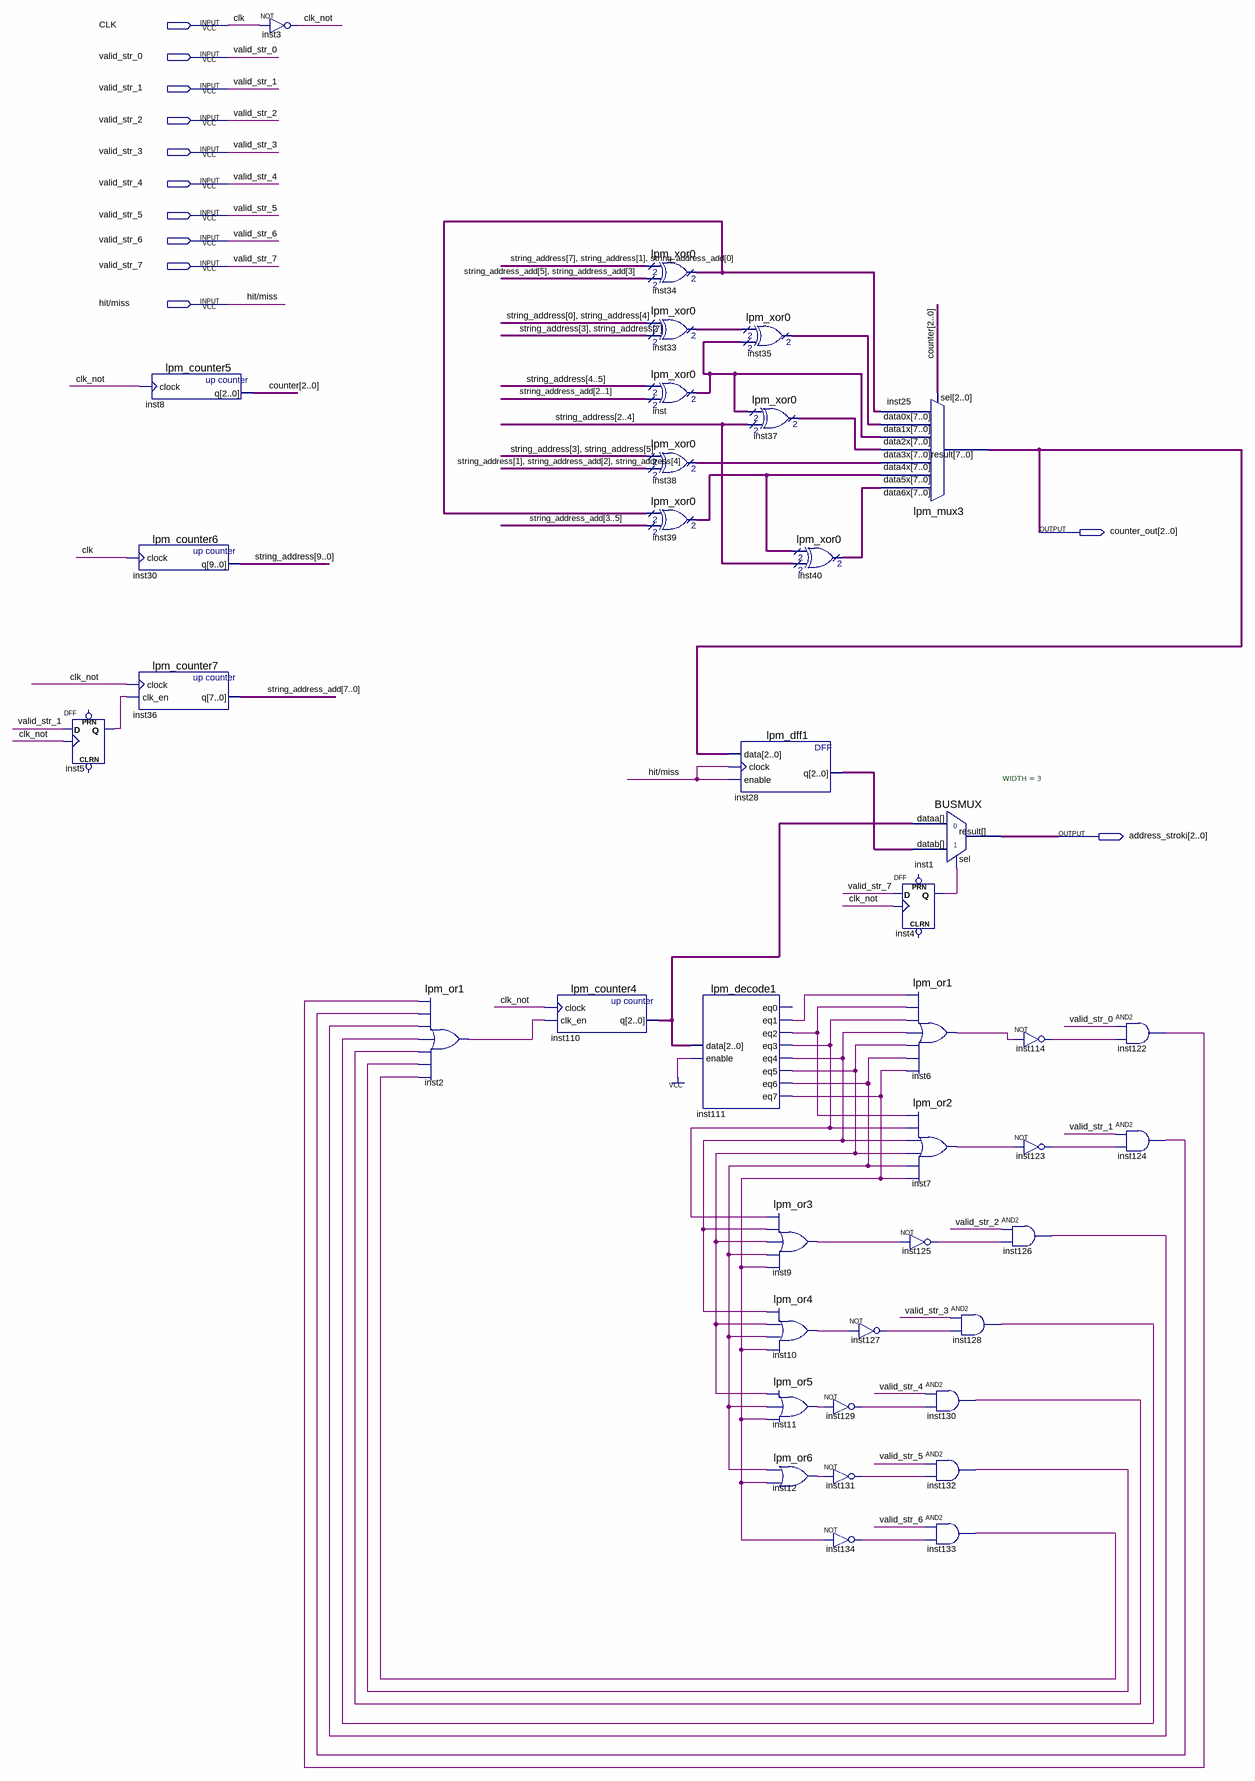
[diagram p0: schematic sheet]
// Quartus schematic Blok_comparing.bdf as structural Verilog: 40 symbols, 12 pins
module Blok_comparing (
  input  CLK,
  input  valid_str_0,
  input  valid_str_1,
  input  valid_str_2,
  input  valid_str_3,
  input  valid_str_4,
  input  valid_str_5,
  input  valid_str_6,
  input  valid_str_7,
  input  \hit/miss ,
  output [2:0] counter_out,
  output [2:0] address_stroki
);

  wire clk_not, inst2_result, inst4_q, inst5_q, inst6_result, inst7_result, inst9_result, inst10_result,
       inst11_result, inst12_result, inst111_eq1, inst111_eq2, inst111_eq3, inst111_eq4, inst111_eq5,
       inst111_eq6, inst111_eq7, inst114_out, inst122_out, inst123_out, inst124_out, inst125_out,
       inst126_out, inst127_out, inst128_out, inst129_out, inst130_out, inst131_out, inst132_out,
       inst133_out, inst134_out;
  wire [1:0] inst33_result;
  wire [2:0] counter, inst28_q, inst110_q;
  wire [7:0] inst34_result, inst35_result, inst37_result, inst38_result, inst39_result, inst40_result,
       inst_result, string_address_add;
  wire [9:0] string_address;

  DFF inst5 (.CLK(clk_not), .D(valid_str_1), .Q(inst5_q));  // open: CLRN, PRN
  lpm_counter5 inst8 (.clock(clk_not), .q(counter));
  lpm_counter6 inst30 (.clock(CLK), .q(string_address));
  lpm_counter7 inst36 (.clock(clk_not), .clk_en(inst5_q), .q(string_address_add));
  not inst3 (clk_not, CLK);
  lpm_or1 inst2 (
    .data0(inst122_out), .data1(inst124_out), .data2(inst126_out), .data3(inst128_out), .data4(inst130_out),
    .data5(inst132_out), .data6(inst133_out), .result(inst2_result));
  lpm_counter4 inst110 (.clock(clk_not), .clk_en(inst2_result), .q(inst110_q));
  lpm_xor0 inst34 (
    .data0x({string_address[7], string_address[1], string_address_add[0]}),
    .data1x({string_address_add[5], string_address_add[3]}), .result(inst34_result));
  lpm_xor0 inst33 (
    .data0x({string_address[0], string_address[4]}), .data1x({string_address[3], string_address[7]}),
    .result(inst33_result));
  lpm_xor0 inst (
    .data0x({string_address[4], string_address[5]}), .data1x(string_address_add[2:1]), .result(inst_result));
  lpm_xor0 inst38 (
    .data0x({string_address[3], string_address[5]}),
    .data1x({string_address[1], string_address_add[2], string_address[4]}), .result(inst38_result));
  lpm_xor0 inst39 (
    .data0x(inst34_result), .data1x({string_address_add[3], string_address_add[4], string_address_add[5]}),
    .result(inst39_result));
  lpm_decode1 inst111 (
    .data(inst110_q), .enable(1'b1), .eq1(inst111_eq1), .eq2(inst111_eq2), .eq3(inst111_eq3),
    .eq4(inst111_eq4), .eq5(inst111_eq5), .eq6(inst111_eq6), .eq7(inst111_eq7));  // open: eq0
  lpm_xor0 inst35 (.data0x(inst33_result), .data1x(inst_result), .result(inst35_result));
  lpm_xor0 inst37 (
    .data0x(inst_result), .data1x({string_address[2], string_address[3], string_address[4]}),
    .result(inst37_result));
  lpm_dff1 inst28 (.data(counter_out), .clock(\hit/miss ), .enable(\hit/miss ), .q(inst28_q));
  lpm_or3 inst9 (
    .data0(inst111_eq3), .data1(inst111_eq4), .data2(inst111_eq5), .data3(inst111_eq6), .data4(inst111_eq7),
    .result(inst9_result));
  lpm_or4 inst10 (
    .data0(inst111_eq4), .data1(inst111_eq5), .data2(inst111_eq6), .data3(inst111_eq7), .result(inst10_result));
  lpm_or5 inst11 (.data0(inst111_eq5), .data1(inst111_eq6), .data2(inst111_eq7), .result(inst11_result));
  lpm_or6 inst12 (.data0(inst111_eq6), .data1(inst111_eq7), .result(inst12_result));
  lpm_xor0 inst40 (
    .data0x(inst39_result), .data1x({string_address[2], string_address[3], string_address[4]}),
    .result(inst40_result));
  not inst127 (inst127_out, inst10_result);
  not inst129 (inst129_out, inst11_result);
  not inst131 (inst131_out, inst12_result);
  not inst134 (inst134_out, inst111_eq7);
  lpm_mux3 inst25 (
    .data6x(inst40_result), .data5x(inst39_result), .data4x(inst38_result), .data3x(inst37_result),
    .data2x(inst_result), .data1x(inst35_result), .data0x(inst34_result), .sel(counter), .result(counter_out));
  BUSMUX #(.WIDTH(3)) inst1 (.datab(inst28_q), .sel(inst4_q), .dataa(inst110_q), .result(address_stroki));
  DFF inst4 (.CLK(clk_not), .D(valid_str_7), .Q(inst4_q));  // open: CLRN, PRN
  lpm_or1 inst6 (
    .data0(inst111_eq1), .data1(inst111_eq2), .data2(inst111_eq3), .data3(inst111_eq4), .data4(inst111_eq5),
    .data5(inst111_eq6), .data6(inst111_eq7), .result(inst6_result));
  lpm_or2 inst7 (
    .data0(inst111_eq2), .data1(inst111_eq3), .data2(inst111_eq4), .data3(inst111_eq5), .data4(inst111_eq6),
    .data5(inst111_eq7), .result(inst7_result));
  not inst125 (inst125_out, inst9_result);
  and inst128 (inst128_out, valid_str_3, inst127_out);
  and inst130 (inst130_out, valid_str_4, inst129_out);
  and inst132 (inst132_out, valid_str_5, inst131_out);
  and inst133 (inst133_out, valid_str_6, inst134_out);
  not inst114 (inst114_out, inst6_result);
  not inst123 (inst123_out, inst7_result);
  and inst126 (inst126_out, valid_str_2, inst125_out);
  and inst122 (inst122_out, valid_str_0, inst114_out);
  and inst124 (inst124_out, valid_str_1, inst123_out);
endmodule
